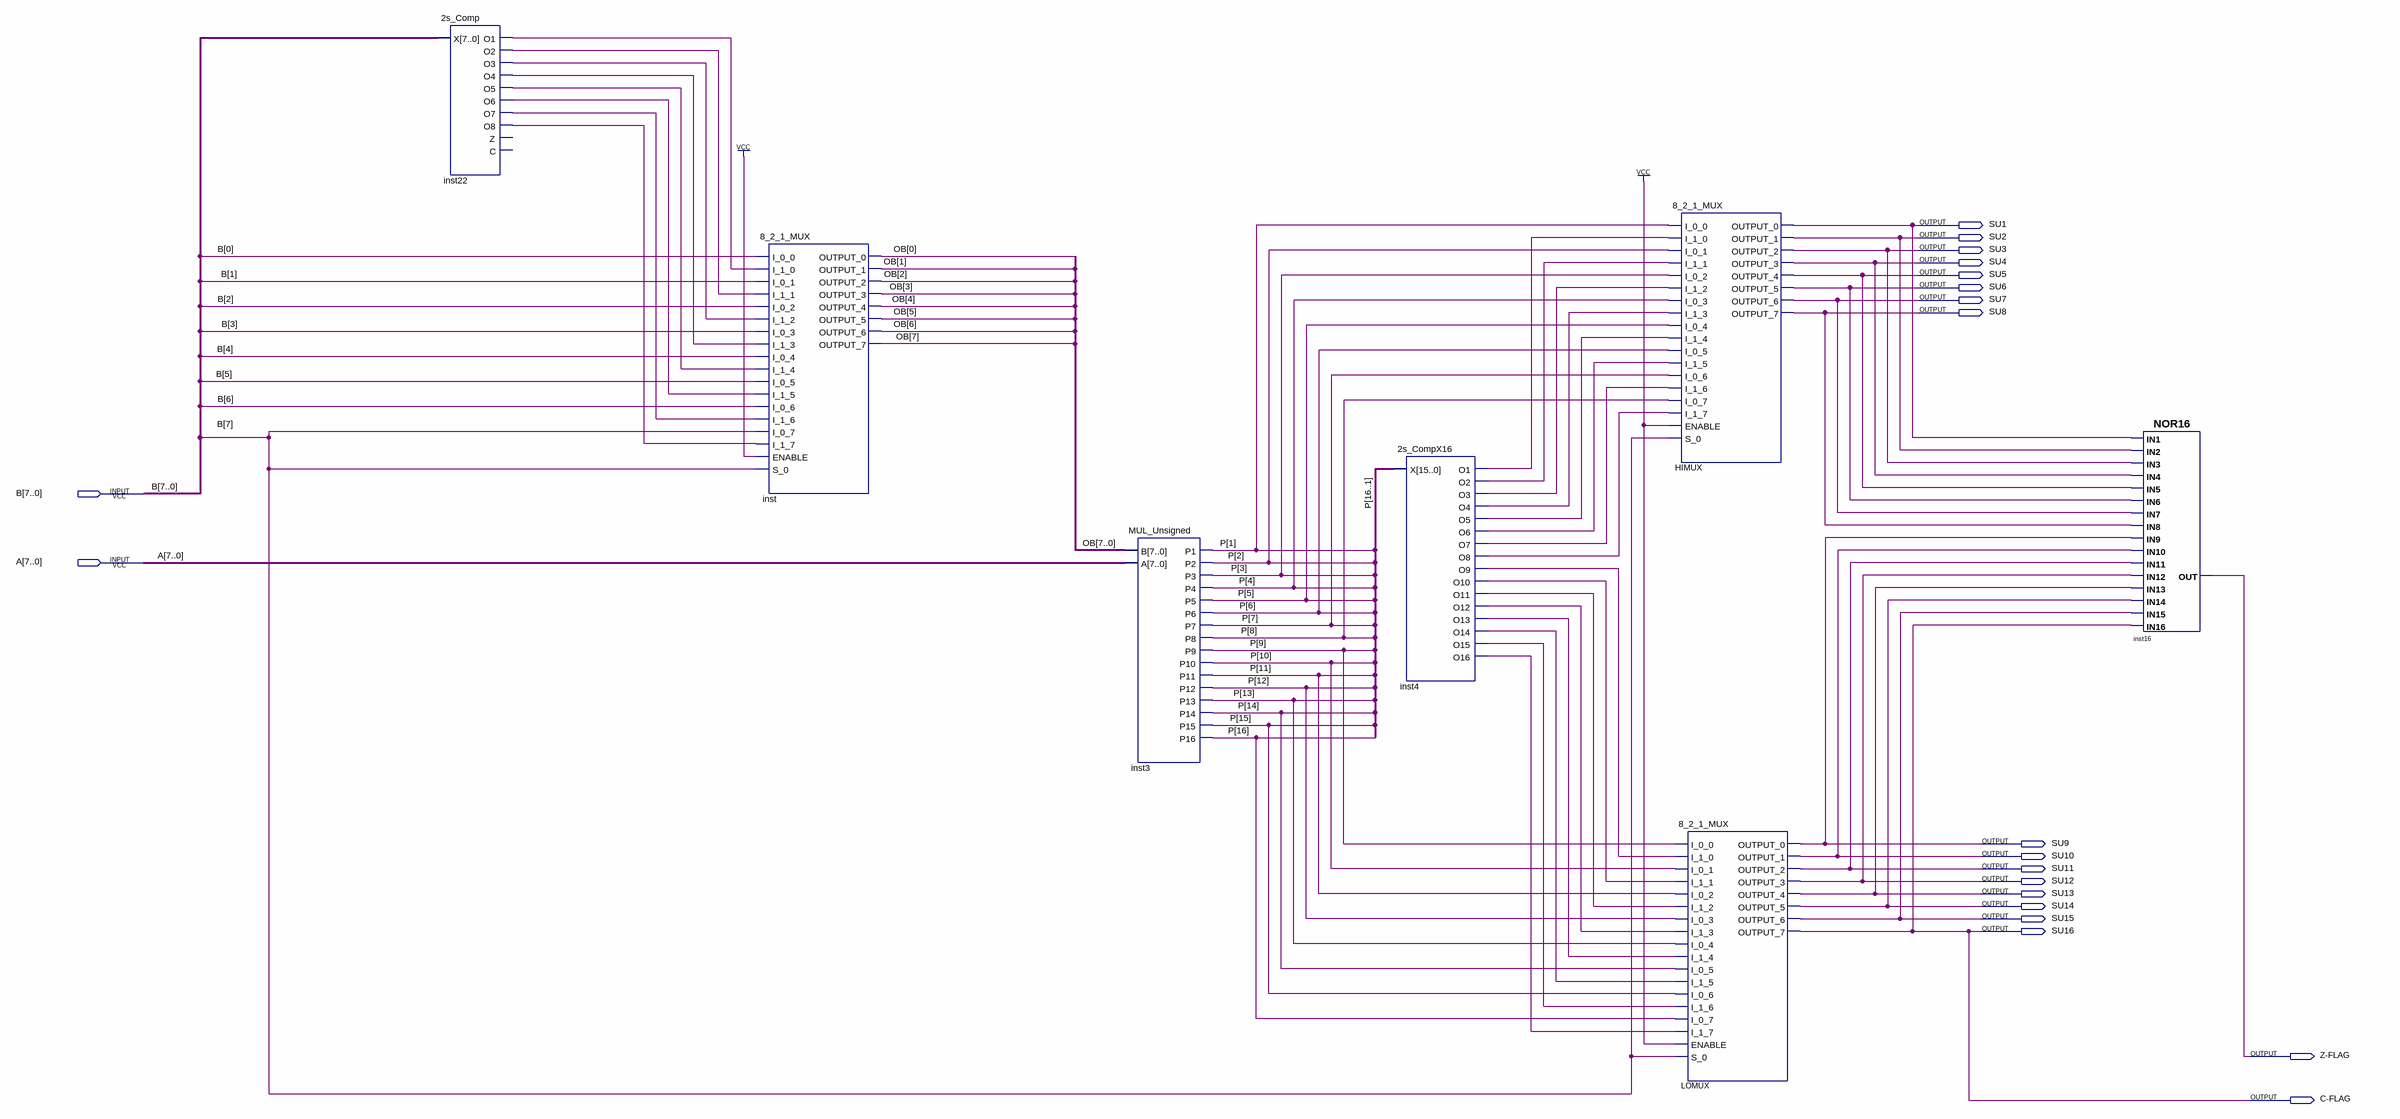
[diagram p0: schematic sheet]
// Quartus schematic MUL-SU.bdf as structural Verilog: 7 symbols, 20 pins
module \MUL-SU  (
  input  [7:0] B,
  input  [7:0] A,
  output SU1,
  output SU2,
  output SU3,
  output SU4,
  output SU5,
  output SU6,
  output SU7,
  output SU8,
  output SU9,
  output SU10,
  output SU11,
  output SU12,
  output SU13,
  output SU14,
  output SU15,
  output SU16,
  output \Z-FLAG ,
  output \C-FLAG 
);

  wire inst4_o1, inst4_o2, inst4_o3, inst4_o4, inst4_o5, inst4_o6, inst4_o7, inst4_o8, inst4_o9, inst4_o10,
       inst4_o11, inst4_o12, inst4_o13, inst4_o14, inst4_o15, inst4_o16, inst22_o1, inst22_o2, inst22_o3,
       inst22_o4, inst22_o5, inst22_o6, inst22_o7, inst22_o8;
  wire [7:0] OB;
  wire [16:1] P;

  \2s_Comp  inst22 (
    .X(B), .O1(inst22_o1), .O2(inst22_o2), .O3(inst22_o3), .O4(inst22_o4), .O5(inst22_o5), .O6(inst22_o6),
    .O7(inst22_o7), .O8(inst22_o8));  // open: Z, C
  \8_2_1_MUX  inst (
    .I_0_0(B[0]), .I_1_0(inst22_o1), .I_0_1(B[1]), .I_1_1(inst22_o2), .I_0_2(B[2]), .I_1_2(inst22_o3),
    .I_0_3(B[3]), .I_1_3(inst22_o4), .I_0_4(B[4]), .I_1_4(inst22_o5), .I_0_5(B[5]), .I_1_5(inst22_o6),
    .I_0_6(B[6]), .I_1_6(inst22_o7), .I_0_7(B[7]), .I_1_7(inst22_o8), .ENABLE(1'b1), .S_0(B[7]),
    .OUTPUT_0(OB[0]), .OUTPUT_1(OB[1]), .OUTPUT_2(OB[2]), .OUTPUT_3(OB[3]), .OUTPUT_4(OB[4]),
    .OUTPUT_5(OB[5]), .OUTPUT_6(OB[6]), .OUTPUT_7(OB[7]));
  MUL_Unsigned inst3 (
    .B(OB), .A(A), .P1(P[1]), .P2(P[2]), .P3(P[3]), .P4(P[4]), .P5(P[5]), .P6(P[6]), .P7(P[7]), .P8(P[8]),
    .P9(P[9]), .P10(P[10]), .P11(P[11]), .P12(P[12]), .P13(P[13]), .P14(P[14]), .P15(P[15]), .P16(P[16]));
  \2s_CompX16  inst4 (
    .X(P), .O1(inst4_o1), .O2(inst4_o2), .O3(inst4_o3), .O4(inst4_o4), .O5(inst4_o5), .O6(inst4_o6),
    .O7(inst4_o7), .O8(inst4_o8), .O9(inst4_o9), .O10(inst4_o10), .O11(inst4_o11), .O12(inst4_o12),
    .O13(inst4_o13), .O14(inst4_o14), .O15(inst4_o15), .O16(inst4_o16));
  \8_2_1_MUX  HIMUX (
    .I_0_0(P[1]), .I_1_0(inst4_o1), .I_0_1(P[2]), .I_1_1(inst4_o2), .I_0_2(P[3]), .I_1_2(inst4_o3),
    .I_0_3(P[4]), .I_1_3(inst4_o4), .I_0_4(P[5]), .I_1_4(inst4_o5), .I_0_5(P[6]), .I_1_5(inst4_o6),
    .I_0_6(P[7]), .I_1_6(inst4_o7), .I_0_7(P[8]), .I_1_7(inst4_o8), .ENABLE(1'b1), .S_0(B[7]),
    .OUTPUT_0(SU1), .OUTPUT_1(SU2), .OUTPUT_2(SU3), .OUTPUT_3(SU4), .OUTPUT_4(SU5), .OUTPUT_5(SU6),
    .OUTPUT_6(SU7), .OUTPUT_7(SU8));
  \8_2_1_MUX  LOMUX (
    .I_0_0(P[9]), .I_1_0(inst4_o9), .I_0_1(P[10]), .I_1_1(inst4_o10), .I_0_2(P[11]), .I_1_2(inst4_o11),
    .I_0_3(P[12]), .I_1_3(inst4_o12), .I_0_4(P[13]), .I_1_4(inst4_o13), .I_0_5(P[14]), .I_1_5(inst4_o14),
    .I_0_6(P[15]), .I_1_6(inst4_o15), .I_0_7(P[16]), .I_1_7(inst4_o16), .ENABLE(1'b1), .S_0(B[7]),
    .OUTPUT_0(SU9), .OUTPUT_1(SU10), .OUTPUT_2(SU11), .OUTPUT_3(SU12), .OUTPUT_4(SU13), .OUTPUT_5(SU14),
    .OUTPUT_6(SU15), .OUTPUT_7(\C-FLAG ));
  nor inst16 (\Z-FLAG , SU1, SU2, SU3, SU4, SU5, SU6, SU7, SU8, SU9, SU10, SU11, SU12, SU13, SU14, SU15, \C-FLAG );

  assign SU16 = \C-FLAG ;
endmodule
